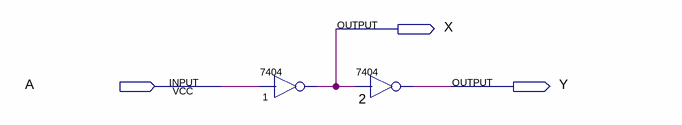
[diagram p0: schematic sheet]
// Quartus schematic Project.bdf as structural Verilog: 2 symbols, 3 pins
module Project (
  input  A,
  output X,
  output Y
);

  \7404  u_1 (.\2 (A), .\1 (X));
  \7404  u_2 (.\2 (X), .\1 (Y));
endmodule
